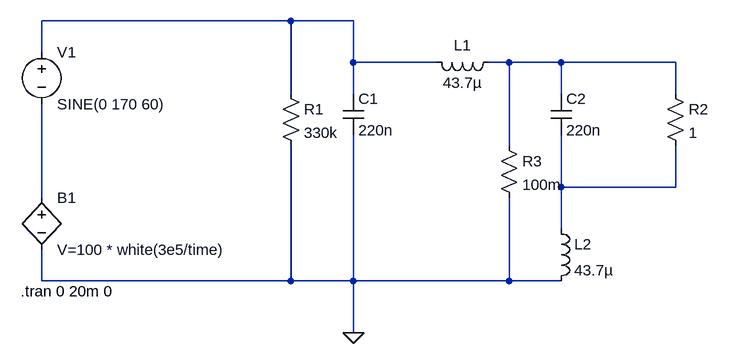
[diagram p0: schematic PowerSupply.asc]
PowerSupply.asc, the LTspice schematic file:
Version 4
SHEET 1 880 680
WIRE -48 -96 -432 -96
WIRE 48 -96 -48 -96
WIRE -432 -48 -432 -96
WIRE 48 -32 48 -96
WIRE 176 -32 48 -32
WIRE 288 -32 256 -32
WIRE 368 -32 288 -32
WIRE 544 -32 368 -32
WIRE -48 16 -48 -96
WIRE 48 16 48 -32
WIRE 368 16 368 -32
WIRE 544 16 544 -32
WIRE 288 96 288 -32
WIRE 368 160 368 80
WIRE 544 160 544 96
WIRE 544 160 368 160
WIRE -432 176 -432 32
WIRE 368 224 368 160
WIRE -432 304 -432 256
WIRE -48 304 -48 96
WIRE -48 304 -432 304
WIRE 48 304 48 80
WIRE 48 304 -48 304
WIRE 288 304 288 176
WIRE 288 304 48 304
WIRE 368 304 288 304
WIRE 48 384 48 304
FLAG 48 384 0
SYMBOL res -64 0 R0
SYMATTR InstName R1
SYMATTR Value 330k
SYMBOL voltage -432 -64 R0
WINDOW 123 0 0 Left 0
WINDOW 39 0 0 Left 0
SYMATTR InstName V1
SYMATTR Value SINE(0 170 60)
SYMBOL bv -432 160 R0
SYMATTR InstName B1
SYMATTR Value V=100 * white(3e5/time)
SYMBOL cap 32 16 R0
SYMATTR InstName C1
SYMATTR Value 220n
SYMBOL ind 272 -48 R90
WINDOW 0 5 56 VBottom 2
WINDOW 3 32 56 VTop 2
SYMATTR InstName L1
SYMATTR Value 43.7µ
SYMBOL ind 352 208 R0
SYMATTR InstName L2
SYMATTR Value 43.7µ
SYMBOL cap 352 16 R0
SYMATTR InstName C2
SYMATTR Value 220n
SYMBOL res 528 0 R0
SYMATTR InstName R2
SYMATTR Value 1
SYMBOL res 272 80 R0
SYMATTR InstName R3
SYMATTR Value 100m
TEXT -464 320 Left 2 !.tran 0 20m 0

The netlist it stands for:
* PowerSupply.asc
R1 N001 0 330k
V1 N001 N004 SINE(0 170 60)
B1 N004 0 V=100 * white(3e5/time)
C1 N001 0 220n
L1 N002 N001 43.7µ
L2 N003 0 43.7µ
C2 N002 N003 220n
R2 N002 N003 1
R3 N002 0 100m
.tran 0 20m 0
.backanno
.end